# Altium schematic sheet 2_wiring drawing.SchDoc: POWER & CAN
size A2; ApprovedBy: Approved By; CheckedBy: Sky Ma; DrawnBy: Jack; Address1: 1; Address2: 2; Address3: 3; Address4: 4; DocumentNumber: 04-TE-42-4015-0PA-A; Revision: B; SheetNumber: 3; SheetTotal: 6; SheetSize: A2; CheckedByDate: 2022-12-5; DrawByDate: 2022-12-5; SiteName: EMS TD Huangpu; : Record=PageOptions|CenterHorizontal=True|CenterVertical=True|PrintScale=0.73|XCorrection=1.00|YCorrection=1.00|PrintKind=0|BorderSize=5000000|LeftOffset=0|BottomOffset=0|Orientation=2|PaperLength=1000|PaperWidth=1000|Scale=100|PaperSource=15|PrintQuality=1200|MediaType=1|DitherType=10|PaperKind=A3|Pr; PageSetup: Record=PageOptions|CenterHorizontal=True|CenterVertical=True|PrintScale=0.52|XCorrection=1.00|YCorrection=1.00|PrintKind=0|BorderSize=5000000|LeftOffset=0|BottomOffset=0|Orientation=2|PaperLength=1000|PaperWidth=1000|Scale=100|PaperSource=15|PrintQuality=1200|MediaType=1|DitherType=10|PaperKind=A4|PrintScaleMode=1; ProjectName: 19205_BMW CCU DDR PCBA FT fixture wiring
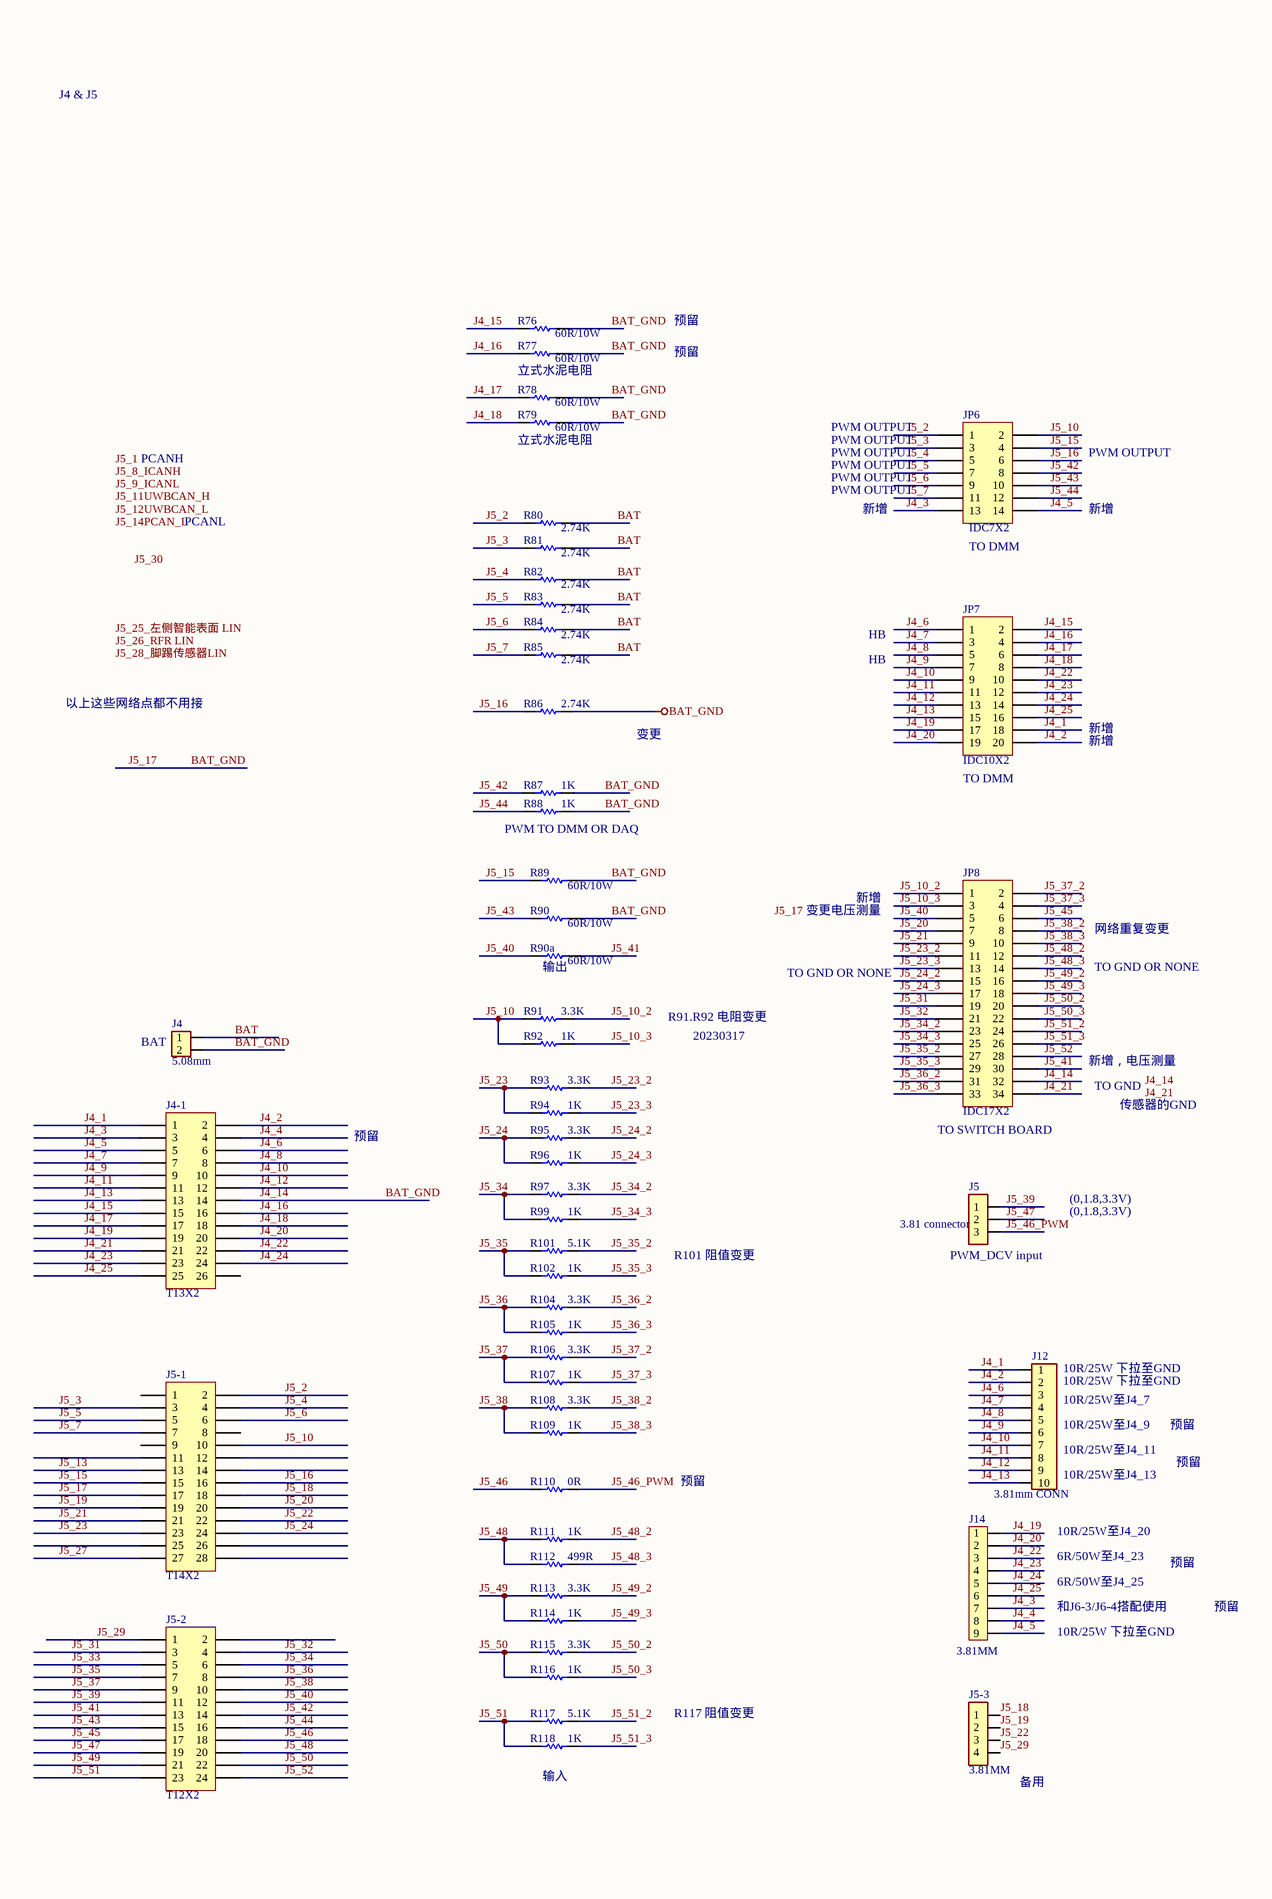
[diagram p0: 2_wiring drawing.SchDoc, left]
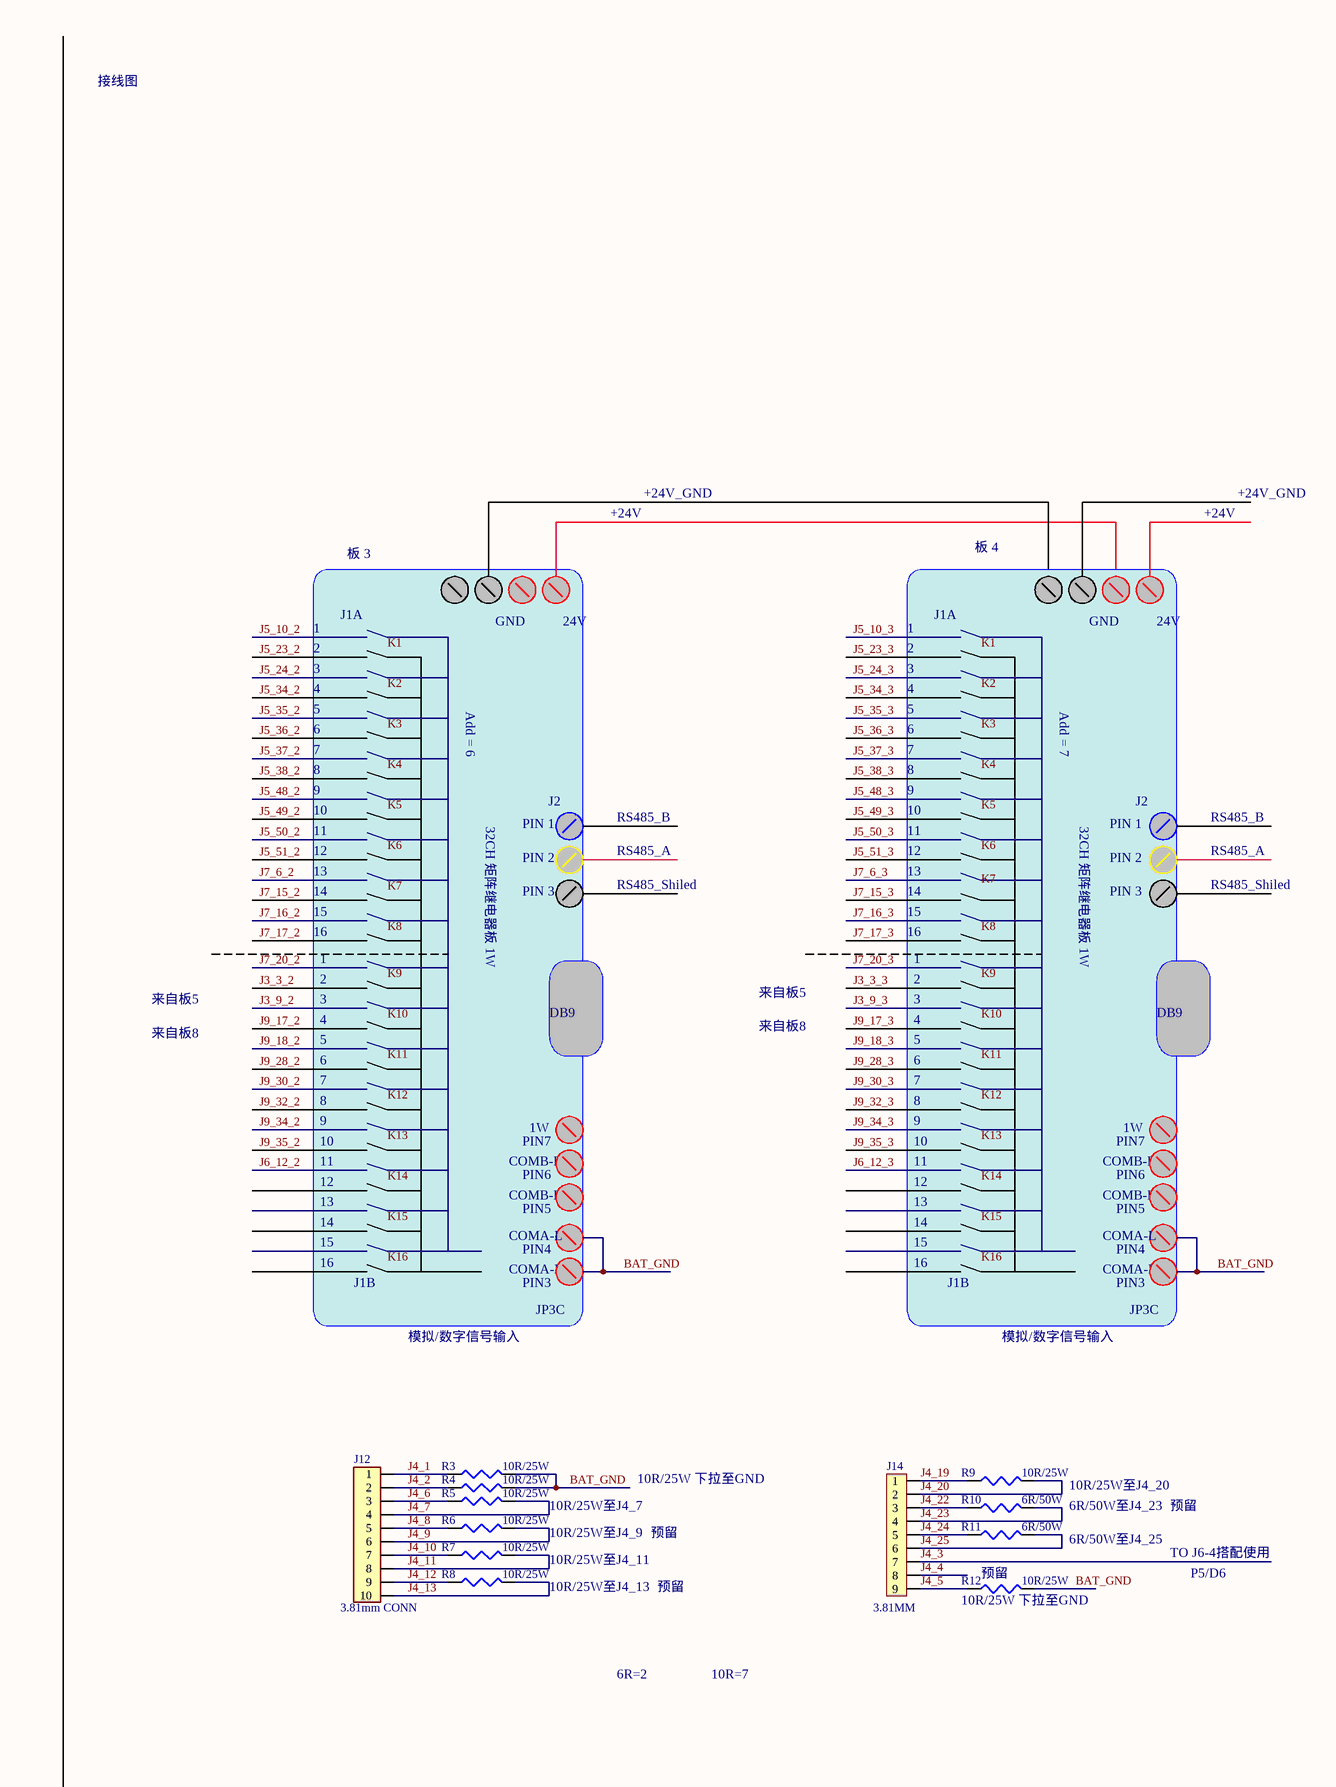
[diagram p1: 2_wiring drawing.SchDoc, right]

## Parts
(Parts that share a designator on the sheet are numbered #1, #2 ... from top to bottom, then left to right.)
J4  5.08mm  [3.81mm-2]
J4-1  T13X2  [T13X2-bend]
J5  3.81 connector  [3.81mm-3]
J5-1  T14X2  [T14X2-bend]
J5-2  T12X2  [T12X2-bend]
J5-3  3.81MM  [3.81mm-4]
J12#1  3.81mm CONN  [3.81mm-10]
J12#2  3.81mm CONN  [3.81mm-10]
J14#1  3.81MM  [3.81mm-9]
J14#2  3.81MM  [3.81mm-9]
JP6  IDC7X2  [IDC14]
JP7  IDC10X2  [IDC20]
JP8  IDC17X2  [IDC34]
R3  10R/25W  [R AXIAL0.4]
R4  10R/25W  [R AXIAL0.4]
R5  10R/25W  [R AXIAL0.4]
R6  10R/25W  [R AXIAL0.4]
R7  10R/25W  [R AXIAL0.4]
R8  10R/25W  [R AXIAL0.4]
R9  10R/25W  [R AXIAL0.4]
R10  6R/50W  [R AXIAL0.4]
R11  6R/50W  [R AXIAL0.4]
R12  10R/25W  [R AXIAL0.4]
R76  60R/10W  [立式10W]
R77  60R/10W  [立式10W]
R78  60R/10W  [立式10W]
R79  60R/10W  [立式10W]
R80  2.74K  [AXIAL-0.25W]
R81  2.74K  [AXIAL-0.25W]
R82  2.74K  [AXIAL-0.25W]
R83  2.74K  [AXIAL-0.25W]
R84  2.74K  [AXIAL-0.25W]
R85  2.74K  [AXIAL-0.25W]
R86  2.74K  [AXIAL-0.25W]
R87  1K  [AXIAL-0.25W]
R88  1K  [AXIAL-0.25W]
R89  60R/10W  [立式10W]
R90  60R/10W  [立式10W]
R90a  60R/10W  [立式10W]
R91  3.3K  [AXIAL-0.25W]
R92  1K  [AXIAL-0.25W]
R93  3.3K  [AXIAL-0.25W]
R94  1K  [AXIAL-0.25W]
R95  3.3K  [AXIAL-0.25W]
R96  1K  [AXIAL-0.25W]
R97  3.3K  [AXIAL-0.25W]
R99  1K  [AXIAL-0.25W]
R101  5.1K  [AXIAL-0.25W]
R102  1K  [AXIAL-0.25W]
R104  3.3K  [AXIAL-0.25W]
R105  1K  [AXIAL-0.25W]
R106  3.3K  [AXIAL-0.25W]
R107  1K  [AXIAL-0.25W]
R108  3.3K  [AXIAL-0.25W]
R109  1K  [AXIAL-0.25W]
R110  0R  [AXIAL-0.25W]
R111  1K  [AXIAL-0.25W]
R112  499R  [AXIAL-0.25W]
R113  3.3K  [AXIAL-0.25W]
R114  1K  [AXIAL-0.25W]
R115  3.3K  [AXIAL-0.25W]
R116  1K  [AXIAL-0.25W]
R117  5.1K  [AXIAL-0.25W]
R118  1K  [AXIAL-0.25W]

## Nets
BAT_GND: J4.2 J4-1.14 J5-1.17 JP8.32 R3.2 R4.2 R12.2 R76.2 R77.2 R78.2 R79.2 R86.2 R87.2 R88.2 R89.2 R90.2  [also labelled J4_14, J5_17]
BAT: J4.1 R80.2 R81.2 R82.2 R83.2 R84.2 R85.2
J4_1: J4-1.1 J12#1.1 J12#2.1 JP7.18 R3.1
J4_2: J4-1.2 J12#1.2 J12#2.2 JP7.20 R4.1
J4_3: J4-1.3 J14#1.7 J14#2.7 JP6.13
J4_4: J4-1.4 J14#1.8 J14#2.8
J4_5: J4-1.5 J14#1.9 J14#2.9 JP6.14 R12.1
J4_6: J4-1.6 J12#1.3 J12#2.3 JP7.1 R5.1
J4_7: J4-1.7 J12#1.4 J12#2.4 JP7.3 R5.2
J4_8: J4-1.8 J12#1.5 J12#2.5 JP7.5 R6.1
J4_9: J4-1.9 J12#1.6 J12#2.6 JP7.7 R6.2
J4_10: J4-1.10 J12#1.7 J12#2.7 JP7.9 R7.1
J4_11: J4-1.11 J12#1.8 J12#2.8 JP7.11 R7.2
J4_12: J4-1.12 J12#1.9 J12#2.9 JP7.13 R8.1
J4_13: J4-1.13 J12#1.10 J12#2.10 JP7.15 R8.2
J4_15: J4-1.15 JP7.2 R76.1
J4_16: J4-1.16 JP7.4 R77.1
J4_17: J4-1.17 JP7.6 R78.1
J4_18: J4-1.18 JP7.8 R79.1
J4_19: J4-1.19 J14#1.1 J14#2.1 JP7.17 R9.1
J4_20: J4-1.20 J14#1.2 J14#2.2 JP7.19 R9.2
J4_21: J4-1.21 JP8.34
J4_22: J4-1.22 J14#1.3 J14#2.3 JP7.10 R10.1
J4_23: J4-1.23 J14#1.4 J14#2.4 JP7.12 R10.2
J4_24: J4-1.24 J14#1.5 J14#2.5 JP7.14 R11.1
J4_25: J4-1.25 J14#1.6 J14#2.6 JP7.16 R11.2
J5_2: J5-1.2 JP6.1 R80.1
J5_3: J5-1.3 JP6.3 R81.1
J5_4: J5-1.4 JP6.5 R82.1
J5_5: J5-1.5 JP6.7 R83.1
J5_6: J5-1.6 JP6.9 R84.1
J5_7: J5-1.7 JP6.11 R85.1
J5_10: J5-1.10 JP6.2 R91.1 R92.1
J5_10_2: JP8.1 R91.2
J5_10_3: JP8.3 R92.2
J5_13: J5-1.13
J5_15: J5-1.15 JP6.4 R89.1
J5_16: J5-1.16 JP6.6 R86.1
J5_18: J5-1.18 J5-3.1
J5_19: J5-1.19 J5-3.2
J5_20: J5-1.20 JP8.7
J5_21: J5-1.21 JP8.9
J5_22: J5-1.22 J5-3.3
J5_23: J5-1.23 R93.1 R94.1
J5_23_2: JP8.11 R93.2
J5_23_3: JP8.13 R94.2
J5_24: J5-1.24 R95.1 R96.1
J5_24_2: JP8.15 R95.2
J5_24_3: JP8.17 R96.2
J5_27: J5-1.27
J5_29: J5-2.1 J5-3.4
J5_31: J5-2.3 JP8.19
J5_32: J5-2.4 JP8.21
J5_33: J5-2.5
J5_34: J5-2.6 R97.1 R99.1
J5_34_2: JP8.23 R97.2
J5_34_3: JP8.25 R99.2
J5_35: J5-2.7 R101.1 R102.1
J5_35_2: JP8.27 R101.2
J5_35_3: JP8.29 R102.2
J5_36: J5-2.8 R104.1 R105.1
J5_36_2: JP8.31 R104.2
J5_36_3: JP8.33 R105.2
J5_37: J5-2.9 R106.1 R107.1
J5_37_2: JP8.2 R106.2
J5_37_3: JP8.4 R107.2
J5_38: J5-2.10 R108.1 R109.1
J5_38_2: JP8.8 R108.2
J5_38_3: JP8.10 R109.2
J5_39: J5.1 J5-2.11
J5_40: J5-2.12 JP8.5 R90a.1
J5_41: J5-2.13 JP8.30 R90a.2
J5_42: J5-2.14 JP6.8 R87.1
J5_43: J5-2.15 JP6.10 R90.1
J5_44: J5-2.16 JP6.12 R88.1
J5_45: J5-2.17 JP8.6
J5_46: J5-2.18 R110.1
J5_46_PWM: J5.3 R110.2
J5_47: J5.2 J5-2.19
J5_48: J5-2.20 R111.1 R112.1
J5_48_2: JP8.12 R111.2
J5_48_3: JP8.14 R112.2
J5_49: J5-2.21 R113.1 R114.1
J5_49_2: JP8.16 R113.2
J5_49_3: JP8.18 R114.2
J5_50: J5-2.22 R115.1 R116.1
J5_50_2: JP8.20 R115.2
J5_50_3: JP8.22 R116.2
J5_51: J5-2.23 R117.1 R118.1
J5_51_2: JP8.24 R117.2
J5_51_3: JP8.26 R118.2
J5_52: J5-2.24 JP8.28

Not connected (* = marked no-connect by the designer): J4-1 26; J5-1 1 8 9 11 12 14 25 26 28; J5-2 2

## Notes on the sheet
- J4 & J5
- 接线图
- 预留
- 立式水泥电阻
- PCANH
- (near R79) 立式水泥电阻
- PWM OUTPUT
- +24V
- +24V_GND
- PCANL
- 新增
- 板 3
- 板 4
- (near JP6) TO DMM
- 1
- 2
- J1A
- GND
- 24V
- HB
- 3
- 4
- 5
- Add = 6
- Add = 7
- 以上这些网络点都不用接
- 变更
- 6
- 7
- 8
- 9
- J2
- (near JP7) TO DMM
- 10
- 11
- 12
- 32CH 矩阵继电器板 1W
- PIN 1
- PIN 2
- RS485_B
- RS485_A
- (near R88) PWM TO DMM OR DAQ
- 13
- 14
- 15
- 16
- PIN 3
- RS485_Shiled
- 变更电压测量
- 来自板5
- (near R90a) 输出
- TO GND OR NONE
- 网络重复变更
- 来自板8
- DB9
- (near J4) BAT
- R91.R92 电阻变更
- 20230317
- 1W
- 新增，电压测量
- TO GND
- 传感器的GND
- COMB-L
- COMB-H
- PIN6
- PIN7
- (near JP8) TO SWITCH BOARD
- COMA-L
- PIN4
- PIN5
- (0,1.8,3.3V)
- J1B
- 模拟/数字信号输入
- COMA-H
- PIN3
- JP3C
- R101 阻值变更
- (near J5) PWM_DCV input
- (near J12#2) 10R/25W 下拉至GND
- (near J12#2) 10R/25W至J4_7
- 10R/25W至J4_7
- 10R/25W至J4_9
- 10R/25W 下拉至GND
- 10R/25W至J4_20
- 6R/50W至J4_23
- (near J12#2) 10R/25W至J4_9
- (near J12#2) 10R/25W至J4_11
- (near J12#2) 10R/25W至J4_13
- 10R/25W至J4_11
- 10R/25W至J4_13
- (near R12) 10R/25W 下拉至GND
- (near R12) 预留
- 6R/50W至J4_25
- TO J6-4搭配使用
- P5/D6
- 和J6-3/J6-4搭配使用
- 6R=2
- 10R=7
- R117 阻值变更
- (near R118) 输入
- (near J5-3) 备用
- Labels drawn without touching a wire or pin: J3_3_2, J3_3_3, J3_9_2, J3_9_3, J4_14, J4_21, J5_1, J5_8_ICANH, J5_9_ICANL, J5_10_2, J5_10_3, J5_11UWBCAN_H, J5_12UWBCAN_L, J5_14PCAN_L, J5_17, J5_23_2, J5_23_3, J5_24_2, J5_24_3, J5_25_左侧智能表面 LIN, J5_26_RFR LIN, J5_28_脚踢传感器LIN, J5_30, J5_34_2, J5_34_3, J5_35_2, J5_35_3, J5_36_2, J5_36_3, J5_37_2, J5_37_3, J5_38_2, J5_38_3, J5_48_2, J5_48_3, J5_49_2, J5_49_3, J5_50_2, J5_50_3, J5_51_2, J5_51_3, J6_12_2, J6_12_3, J7_6_2, J7_6_3, J7_15_2, J7_15_3, J7_16_2, J7_16_3, J7_17_2, J7_17_3, J7_20_2, J7_20_3, J9_17_2, J9_17_3, J9_18_2, J9_18_3, J9_28_2, J9_28_3, J9_30_2, J9_30_3, J9_32_2, J9_32_3, J9_34_2, J9_34_3, J9_35_2, J9_35_3, K1, K2, K3, K4, K5, K6, K7, K8, K9, K10, K11, K12, K13, K14, K15, K16
- Document Number:
- Rev:
- Project Name:
- Drawn By:
- Date:
- Titile:
- Checked By:
- Sheet:
- Of

## Library data of the parts
J4 = CON2-3.81
J4-1 = IDC13X2
J5 = CON3-3.81
J5-3 = CON4-3.81
J12#1 J12#2 = CON10-3.81
J14#1 J14#2 = CON9-3.81
R3-R12 = RES2
R76-R90 R90a R91-R97 R99 R101 R102 R104-R118 = RES1